# Altium schematic sheet PROC010C_LDO.SchDoc
size 431 x 279 mm; Date: Not shown in title block; ApprovedBy: Not shown in title block; CheckedBy: Not shown in title block; Author: Not shown in title block; CompanyName: Not shown in title block; DrawnBy: Adrian Ozer; Engineer: Not shown in title block; Organization: Not shown in title block; Address1: Not shown in title block; Address2: Not shown in title block; Address3: Not shown in title block; Address4: Not shown in title block; DocumentNumber: 9; Revision: Use project parameter SCH_Rev; SheetNumber: 9; SheetTotal: 16; PageSetup: Record=PageOptions|CenterHorizontal=True|CenterVertical=True|PrintScale=1.00|XCorrection=1.00|YCorrection=1.00|PrintKind=0|BorderSize=5000000|LeftOffset=0|BottomOffset=0|Orientation=2|PaperLength=1000|PaperWidth=1000|Scale=100|PaperSource=15|PrintQuality=600|MediaType=1|DitherType=10|PaperKind=Letter|PrintScaleMode=1; CurrentTime: Not shown in title block; CurrentDate: Not shown in title block; Time: Not shown in title block; DocumentFullPathAndName: Not shown in title block; DocumentName: Not shown in title block; ModifiedDate: Not shown in title block; ImagePath: Not shown in title block
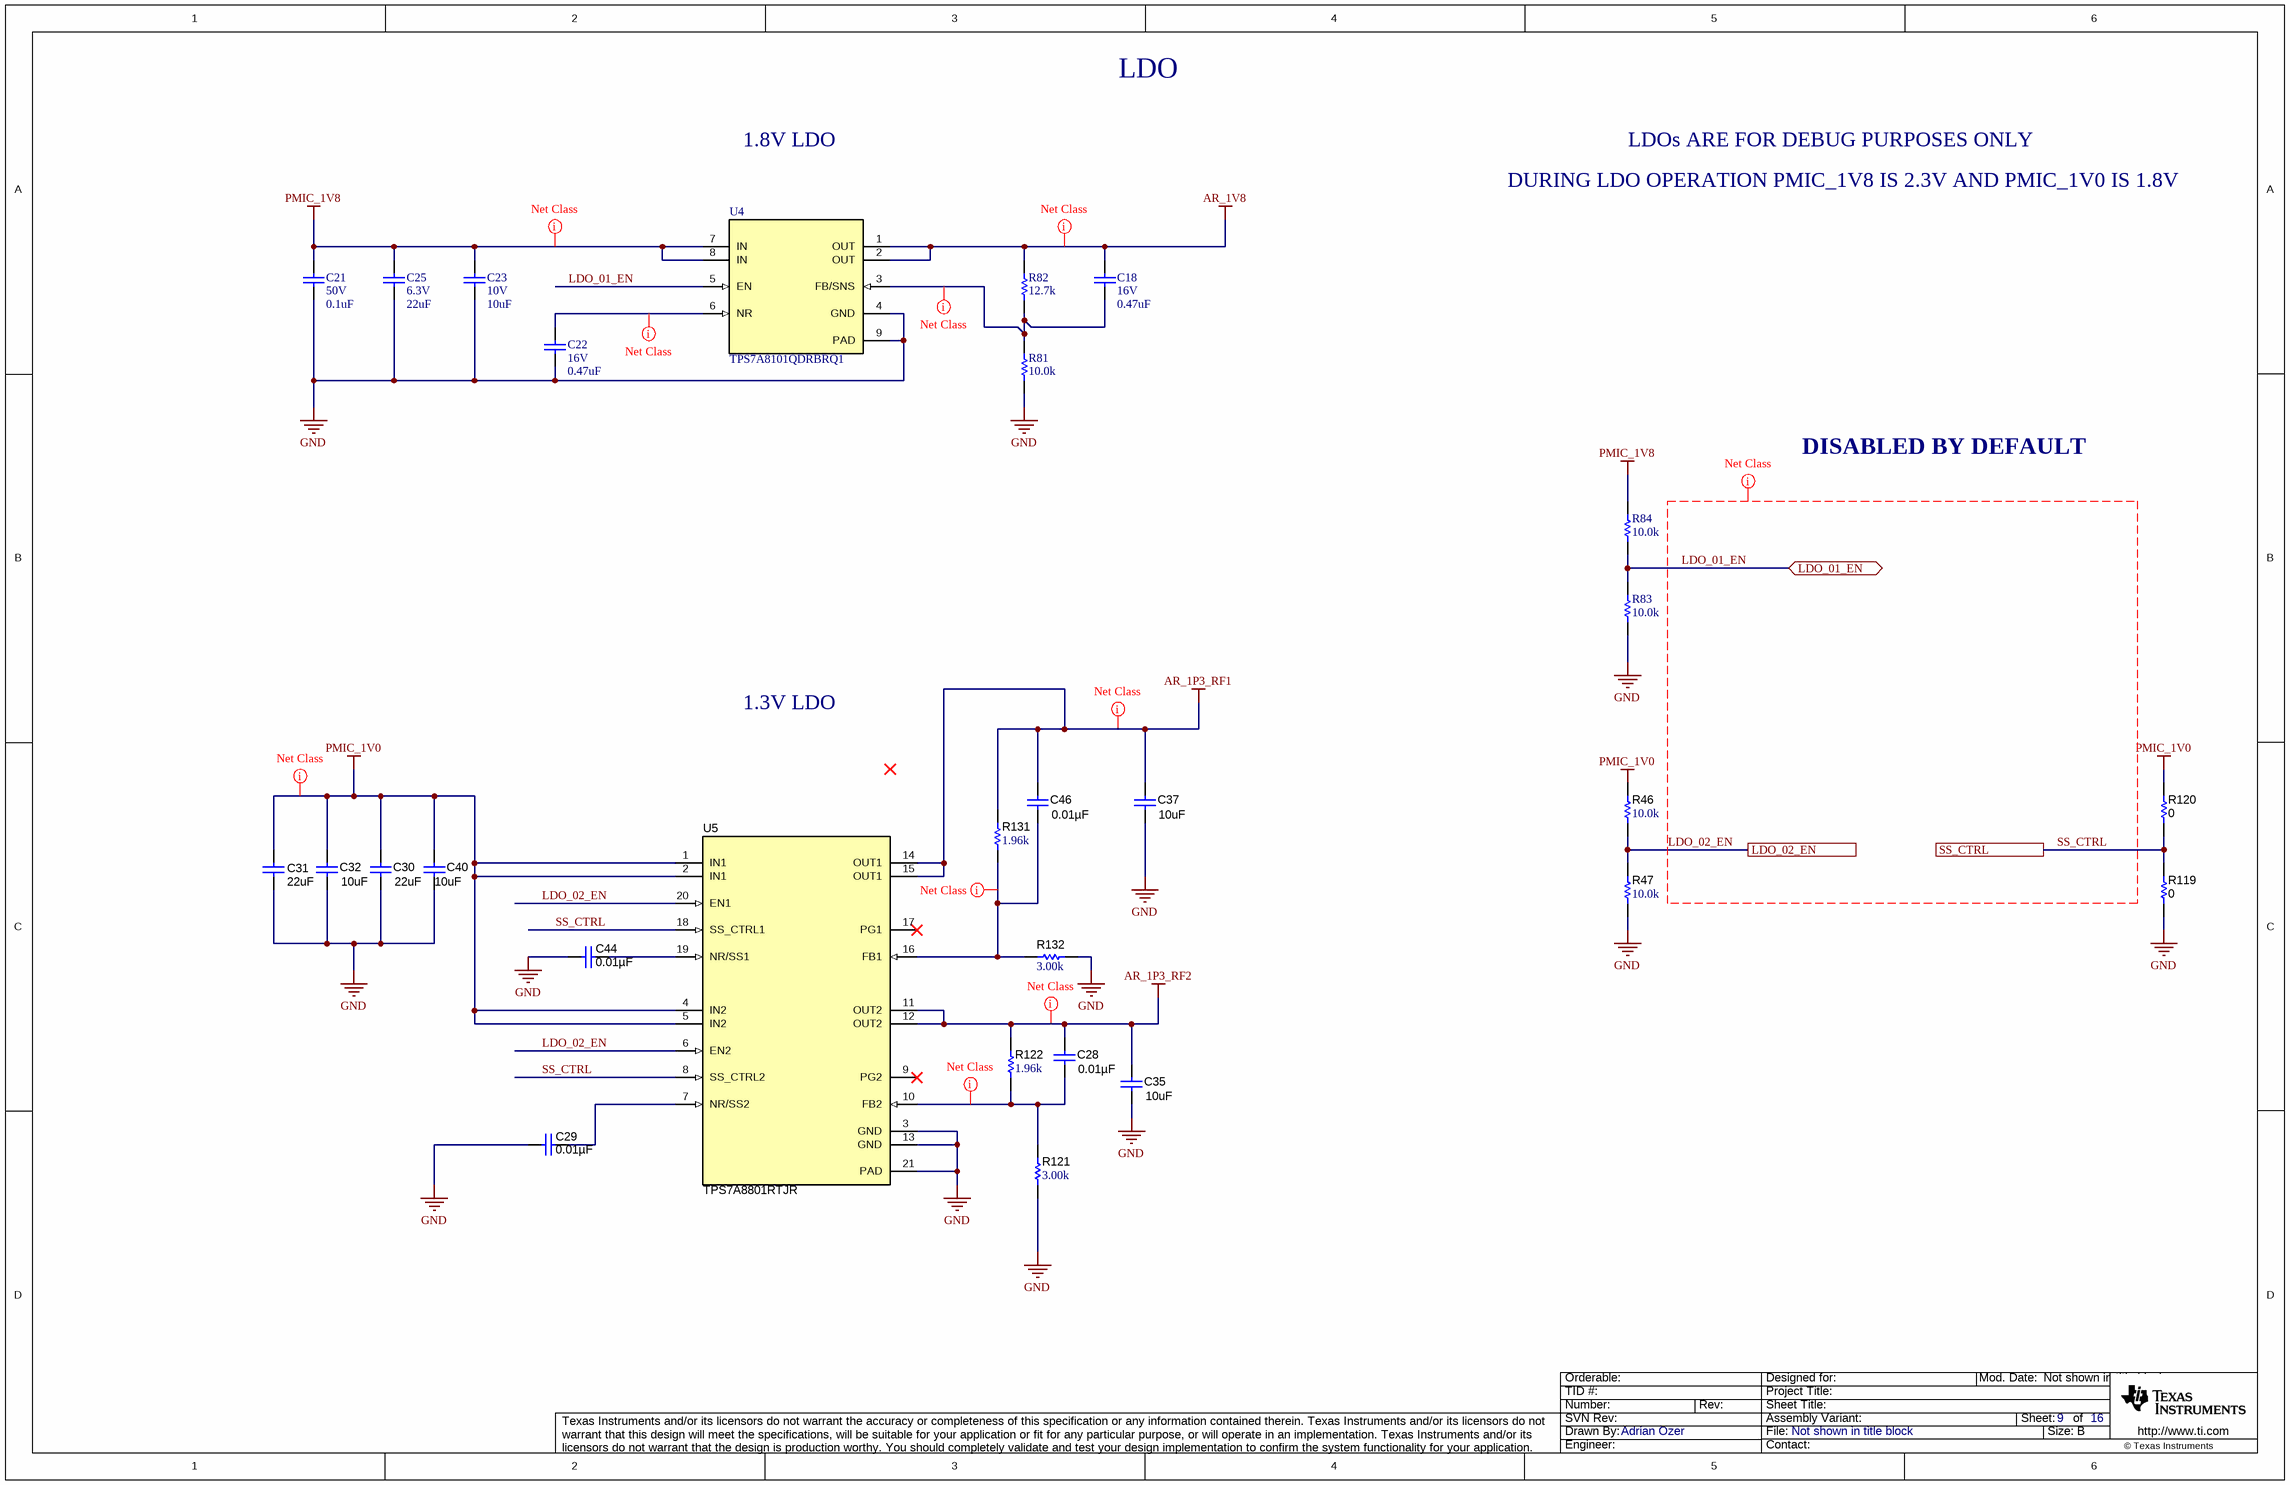
[diagram p0: PROC010C_LDO.SchDoc]

## Parts
C18  VDC_V: 16V  ValueDisplayed: 0.47uF  [0603]  (hidden comment: GCM188R71C474KA55D)
C21  VDC_V: 50V  ValueDisplayed: 0.1uF  [0402]  (hidden comment: CGA2B3X7R1H104K050BB)
C22  VDC_V: 16V  ValueDisplayed: 0.47uF  [0603]  (hidden comment: GCM188R71C474KA55D)
C23  VDC_V: 10V  ValueDisplayed: 10uF  [0805_HV]  (hidden comment: GCM21BR71A106KE22L)
C25  VDC_V: 6.3V  ValueDisplayed: 22uF  [1206_180]  (hidden comment: CGA5L1X7R0J226M160AC)
C28  ValueDisplayed: 0.01µF  [0402L]  (hidden comment: CGA2B3X8R1H103K050BB)
C29  ValueDisplayed: 0.01µF  [0402L]  (hidden comment: CGA2B3X8R1H103K050BB)
C30  ValueDisplayed: 22uF  [1206_180]  (hidden comment: CGA5L1X7R0J226M160AC)
C31  ValueDisplayed: 22uF  [1206_180]  (hidden comment: CGA5L1X7R0J226M160AC)
C32  ValueDisplayed: 10uF  [0805]  (hidden comment: GCM21BR71A106KE22L)
C35  ValueDisplayed: 10uF  [0805_HV]  (hidden comment: GCM21BR71A106KE22L)
C37  ValueDisplayed: 10uF  [0805_HV]  (hidden comment: GCM21BR71A106KE22L)
C40  ValueDisplayed: 10uF  [0805_HV1]  (hidden comment: GCM21BR71A106KE22L)
C44  ValueDisplayed: 0.01µF  [0402L]  (hidden comment: CGA2B3X8R1H103K050BB)
C46  ValueDisplayed: 0.01µF  [0402L]  (hidden comment: CGA2B3X8R1H103K050BB)
R46  ValueDisplayed: 10.0k  [0402L]  (hidden comment: CRCW040210K0FKED)
R47  ValueDisplayed: 10.0k  [0402L]  (hidden comment: CRCW040210K0FKED)
R81  ValueDisplayed: 10.0k  [0402L]  (hidden comment: CRCW040210K0FKED)
R82  ValueDisplayed: 12.7k  [0402L]  (hidden comment: CRCW040212K7FKED)
R83  ValueDisplayed: 10.0k  [0402]  (hidden comment: CRCW040210K0FKED)
R84  ValueDisplayed: 10.0k  [0402]  (hidden comment: CRCW040210K0FKED)
R119  ValueDisplayed: 0  [0402L]  (hidden comment: ERJ-2GE0R00X)
R120  ValueDisplayed: 0  [0402L]  (hidden comment: ERJ-2GE0R00X)
R121  ValueDisplayed: 3.00k  [0402L]  (hidden comment: CRCW04023K00FKED)
R122  ValueDisplayed: 1.96k  [0402L]  (hidden comment: CRCW04021K96FKED)
R131  ValueDisplayed: 1.96k  [0402L]  (hidden comment: CRCW04021K96FKED)
R132  ValueDisplayed: 3.00k  [0402L]  (hidden comment: CRCW04023K00FKED)
U4  TPS7A8101QDRBRQ1  [DRB0008A]
U5  TPS7A8801RTJR  [RTJ0020D]

## Ports
LDO_01_EN (bidir), LDO_02_EN, SS_CTRL

## Nets
AR_1P3_RF1: C37.2 C46.2 R131.2 U5.14(OUT1) U5.15(OUT1)
AR_1P3_RF2: C28.2 C35.2 R122.2 U5.11(OUT2) U5.12(OUT2)
AR_1V8: C18.1 R82.2 U4.1(OUT) U4.2(OUT)
GND: C21.2 C22.2 C23.2 C25.2 C29.1 C30.1 C31.1 C32.1 C35.1 C37.1 C40.1 C44.1 R47.2 R81.1 R83.1 R119.1 R121.1 R132.1 U4.4(GND) U4.9(PAD) U5.3(GND) U5.13(GND) U5.21(PAD)
PMIC_1V0: C30.2 C31.2 C32.2 C40.2 R46.1 R120.2 U5.1(IN1) U5.2(IN1) U5.4(IN2) U5.5(IN2)
PMIC_1V8: C21.1 C23.1 C25.1 R84.2 U4.7(IN) U4.8(IN)
LDO_01_EN: R83.2 R84.1 U4.5(EN) ; port LDO_01_EN
LDO_02_EN: R46.2 R47.1 U5.6(EN2) U5.20(EN1) ; port LDO_02_EN
SS_CTRL: R119.2 R120.1 U5.8(SS_CTRL2) U5.18(SS_CTRL1) ; port SS_CTRL
NetC18_2: C18.2 R81.2 R82.1 U4.3(FB/SNS)
NetC22_1: C22.1 U4.6(NR)
NetC28_1: C28.1 R121.2 R122.1 U5.10(FB2)
NetC29_2: C29.2 U5.7(NR/SS2)
NetC44_2: C44.2 U5.19(NR/SS1)
NetC46_1: C46.1 R131.1 R132.2 U5.16(FB1)

Not connected (* = marked no-connect by the designer): U5 9(PG2)* 17(PG1)*

## Layout directives
net class PWR: AR_1P3_RF1, AR_1P3_RF2, AR_1V8, NetC18_2, NetC28_1, NetC46_1, PMIC_1V0, PMIC_1V8
net class GENERAL: LDO_01_EN, LDO_02_EN, NetC22_1, SS_CTRL

## Notes on the sheet
- LDO
- 1.8V LDO
- LDOs ARE FOR DEBUG PURPOSES ONLY
- DURING LDO OPERATION PMIC_1V8 IS 2.3V AND PMIC_1V0 IS 1.8V
- DISABLED BY DEFAULT
- 1.3V LDO
- Drawn By:
- SVN Rev:
- Number:
- TID #:
- Orderable:
- Rev:
- Sheet Title:
- File:
- Project Title:
- Designed for:
- Assembly Variant:
- Mod. Date:
- Sheet:
- Size:
- of
- B
- http://www.ti.com
- Texas Instruments and/or its licensors do not warrant the accuracy or completeness of this specification or any information contained therein. Texas Instruments and/or its licensors do not warrant that this design will meet the specifications, will be suitable for your application or fit for any particular purpose, or will operate in an implementation. Texas Instruments and/or its licensors do not warrant that the design is production worthy. You should completely validate and test your design implementation to confirm the system functionality for your application.
- Engineer:
- Contact:
- © Texas Instruments

## Library data of the parts
C18 C22 = CMP-0007138-4: CAP, CERM, 0.47 uF, 16 V, +/- 10%, X7R, AEC-Q200 Grade 1, 0603; Manufacturer: MuRata; TaMin_C: -55°C; Polarized: N; SizeAreaWB_mm2: 4.68; Value1: Unknown; U/M: EA; Value: 0.47uF; TaMax_C: 125°C; SizeZ_mm: 1; SizeX_mm: 1.6; SizeY_mm: 0.8; SizeArea_mm2: 1.28; AEC Qualified: Y; Cap_F: 470nF; AEC Category: Q200; Supplier Part Number 2: 45Y5163; Publisher: Texas Instruments; Supplier 2: Newark; TempCo: X7R; Published: 2008-06-19; RoHS: Y; MountType: SMT; Supplier 1: Digi-Key; PackageReference: 0603; Tolerance_%: 10%; Cap_Case: 0603; Value2: 16V; CompType: Capacitor; LatestRevisionDate: 2017-03-09; PartNumber: GCM188R71C474KA55D; ComponentLink1Description: Datasheet link; AEC Grade: 1; Supplier Part Number 1: 490-4775-1-ND; Technology: Ceramic; ComponentLink1URL: http://psearch.en.murata.com/capacitor/product/GCM188R71C474KA55%23.pdf
C21 = CMP-0006325-2: CAP, CERM, 0.1 uF, 50 V, +/- 10%, X7R, AEC-Q200 Grade 1, 0402; Manufacturer: TDK; TaMin_C: -55°C; ESR_ohm: 0.039064; Polarized: N; SizeAreaWB_mm2: 3; Value1: 0.039064 ohm; U/M: EA; Value: 0.1uF; TaMax_C: 125°C; SizeZ_mm: 0.6; SizeX_mm: 1; SizeY_mm: 0.5; AEC Qualified: Y; Cap_F: 100nF; IRMS_A: 8.14669dA; AEC Category: Q200; Supplier Part Number 2: 04X3148; Publisher: Texas Instruments; Supplier 2: Newark; Supplier Part Number 3: 810-CGA2B3X7R1H104K; TempCo: X7R; Supplier 3: Mouser; Published: 2008-06-19; RoHS: Y; MountType: SMT; Supplier 1: Digi-Key; PackageReference: 0402; Tolerance_%: 10%; Cap_Case: 0402; Value2: 50V; SizeArea_mm2: 0.5; CompType: Capacitor; LatestRevisionDate: 2017-03-09; PartNumber: CGA2B3X7R1H104K050BB; ComponentLink1Description: Datasheet link; AEC Grade: 1; Supplier Part Number 1: 445-6899-1-ND; Technology: Ceramic; ComponentLink1URL: https://product.tdk.com/en/search/capacitor/ceramic/mlcc/info?part_no=CGA2B3X7R1H104K050BB
C23 = CMP-0008017-2: CAP, CERM, 10 uF, 10 V, +/- 10%, X7R, 0805; Manufacturer: MuRata; TaMin_C: -55°C; Polarized: N; SizeAreaWB_mm2: 6.75; Value1: Unknown; U/M: EA; Value: 10uF; TaMax_C: 125°C; SizeZ_mm: 1.45; SizeX_mm: 2; SizeY_mm: 1.25; Cap_Case: 0805; SizeArea_mm2: 2.5; Cap_F: 10µF; AEC Category: Q200; Supplier Part Number 2: 06AC6014; Publisher: Texas Instruments; Supplier 2: Newark; Supplier Part Number 3: 81-GCM21BR71A106KE2L; TempCo: X7R; Supplier 3: Mouser; Published: 2008-06-19; RoHS: Y; MountType: SMT; Supplier 1: Digi-Key; PackageReference: 0805; Tolerance_%: 10%; Value2: 10V; CompType: Capacitor; LatestRevisionDate: 2017-03-09; PartNumber: GCM21BR71A106KE22L; AEC Qualified: ?; ComponentLink1Description: Datasheet link; Supplier Part Number 1: 490-10674-1-ND; Technology: Ceramic; ComponentLink1URL: http://www.murata.com/products/catalog/pdf/c03e.pdf
C25 = CMP-0008770-2: CAP, CERM, 22 uF, 6.3 V, +/- 10%, X7R, AEC-Q200 Grade 1, 1206; Manufacturer: TDK; TaMin_C: -55°C; ESR_ohm: 1.872m; Polarized: N; SizeAreaWB_mm2: 10.92; Value1: 0.001872 ohm; U/M: EA; Value: 22uF; SizeZ_mm: 1.8; SizeX_mm: 3.2; SizeY_mm: 1.6; SizeArea_mm2: 5.12; AEC Qualified: Y; Cap_F: 22µF; IRMS_A: 5.30203A; AEC Grade: 1; AEC Category: Q200; TaMax_C: 125°C; Supplier Part Number 2: 52W9837; Publisher: Texas Instruments; Supplier 2: Newark; Supplier Part Number 3: 810-CGA5L1X7R0J226M; TempCo: X7R; Supplier 3: Mouser; Published: 2008-06-19; RoHS: Y; MountType: SMT; Supplier 1: Digi-Key; PackageReference: 1206; Tolerance_%: 10%; Cap_Case: 1206_180; Value2: 6.3V; CompType: Capacitor; LatestRevisionDate: 2017-03-09; PartNumber: CGA5L1X7R0J226M160AC; ComponentLink1Description: Datasheet link; Supplier Part Number 1: 445-7884-1-ND; Technology: Ceramic; ComponentLink1URL: https://product.tdk.com/en/search/capacitor/ceramic/mlcc/info?part_no=CGA5L1X7R0J226M160AC
C28 C29 C44 C46 = CMP-0078224-1: CAP, CERM, 0.01 µF, 50 V,+/- 10%, X8R, AEC-Q200 Grade 0, 0402; Manufacturer: TDK; TaMin_C: -55°C; Polarized: N; SizeAreaWB_mm2: 3; U/M: EA; Value: 0.01uF; TaMax_C: 150°C; SizeZ_mm: 0.6; SizeX_mm: 1; SizeY_mm: 0.5; Cap_Case: 0402; Value2: 50V; AEC Qualified: Y; Cap_F: 10nF; AEC Grade: 0; AEC Category: Q200; ComponentLink1URL: https://product.tdk.com/info/en/catalog/datasheets/mlcc_automotive_hightemp_en.pdf; Supplier Part Number 2: 51X6485; Supplier 2: Newark; Supplier Part Number 3: 810-CGA2B3X8R1H103KB; TempCo: X8R; Supplier 3: Mouser; RoHS: Y; MountType: SMT; Supplier 1: Digi-Key; PackageReference: 0402; Tolerance_%: 10%; SizeArea_mm2: 0.5; CompType: Capacitor; PartNumber: CGA2B3X8R1H103K050BB; VDC_V: 50V; ComponentLink1Description: Datasheet link; Supplier Part Number 1: 445-12303-1-ND; Technology: Ceramic
C30 C31 = CMP-0008770-2: CAP, CERM, 22 uF, 6.3 V, +/- 10%, X7R, AEC-Q200 Grade 1, 1206; Manufacturer: TDK; TaMin_C: -55°C; ESR_ohm: 1.872m; Polarized: N; SizeAreaWB_mm2: 10.92; Value1: 0.001872 ohm; U/M: EA; Value: 22uF; SizeZ_mm: 1.8; SizeX_mm: 3.2; SizeY_mm: 1.6; Value2: 6.3V; SizeArea_mm2: 5.12; AEC Qualified: Y; Cap_F: 22µF; IRMS_A: 5.30203A; AEC Grade: 1; AEC Category: Q200; TaMax_C: 125°C; Supplier Part Number 2: 52W9837; Publisher: Texas Instruments; Supplier 2: Newark; Supplier Part Number 3: 810-CGA5L1X7R0J226M; TempCo: X7R; Supplier 3: Mouser; Published: 2008-06-19; RoHS: Y; MountType: SMT; Supplier 1: Digi-Key; PackageReference: 1206; Tolerance_%: 10%; Cap_Case: 1206_180; CompType: Capacitor; LatestRevisionDate: 2017-03-09; PartNumber: CGA5L1X7R0J226M160AC; VDC_V: 6.3V; ComponentLink1Description: Datasheet link; Supplier Part Number 1: 445-7884-1-ND; Technology: Ceramic; ComponentLink1URL: https://product.tdk.com/en/search/capacitor/ceramic/mlcc/info?part_no=CGA5L1X7R0J226M160AC
C32 = CMP-0008017-2: CAP, CERM, 10 uF, 10 V, +/- 10%, X7R, 0805; Manufacturer: MuRata; TaMin_C: -55°C; Polarized: N; SizeAreaWB_mm2: 6.75; Value1: Unknown; U/M: EA; Value: 10uF; TaMax_C: 125°C; SizeZ_mm: 1.45; SizeX_mm: 2; SizeY_mm: 1.25; Value2: 10V; SizeArea_mm2: 2.5; CompType: Capacitor; Cap_F: 10µF; AEC Category: Q200; Supplier Part Number 2: 06AC6014; Publisher: Texas Instruments; Supplier 2: Newark; Supplier Part Number 3: 81-GCM21BR71A106KE2L; TempCo: X7R; Supplier 3: Mouser; Published: 2008-06-19; RoHS: Y; MountType: SMT; Supplier 1: Digi-Key; PackageReference: 0805; Tolerance_%: 10%; Cap_Case: 0805; LatestRevisionDate: 2017-03-09; PartNumber: GCM21BR71A106KE22L; AEC Qualified: ?; VDC_V: 10V; ComponentLink1Description: Datasheet link; Supplier Part Number 1: 490-10674-1-ND; Technology: Ceramic; ComponentLink1URL: http://www.murata.com/products/catalog/pdf/c03e.pdf
C35 C37 C40 = CMP-0008017-2: CAP, CERM, 10 uF, 10 V, +/- 10%, X7R, 0805; Manufacturer: MuRata; TaMin_C: -55°C; Polarized: N; SizeAreaWB_mm2: 6.75; Value1: Unknown; U/M: EA; Value: 10uF; TaMax_C: 125°C; SizeZ_mm: 1.45; SizeX_mm: 2; SizeY_mm: 1.25; Cap_Case: 0805; Value2: 10V; SizeArea_mm2: 2.5; CompType: Capacitor; Cap_F: 10µF; AEC Category: Q200; Supplier Part Number 2: 06AC6014; Publisher: Texas Instruments; Supplier 2: Newark; Supplier Part Number 3: 81-GCM21BR71A106KE2L; TempCo: X7R; Supplier 3: Mouser; Published: 2008-06-19; RoHS: Y; MountType: SMT; Supplier 1: Digi-Key; PackageReference: 0805; Tolerance_%: 10%; LatestRevisionDate: 2017-03-09; PartNumber: GCM21BR71A106KE22L; AEC Qualified: ?; VDC_V: 10V; ComponentLink1Description: Datasheet link; Supplier Part Number 1: 490-10674-1-ND; Technology: Ceramic; ComponentLink1URL: http://www.murata.com/products/catalog/pdf/c03e.pdf
R46 R47 R83 R84 = CMP-0025958-3: RES, 10.0 k, 1%, 0.063 W, AEC-Q200 Grade 0, 0402; Manufacturer: Vishay-Dale; Power_W: 63mW; TempCo: 100 ppm/C; Value_Code: 10k0; Value: 10.0k; EIA_Code: E96; Res_ohm: 10k; SizeX_mm: 1; SizeY_mm: 0.5; SizeZ_mm: 0.6; Value2: 0.063W; AEC Qualified: Y; VDC_V: 50V; AEC Category: Q200; AEC Grade: 0; Supplier Part Number 2: 52K6595; Supplier 2: Newark; Supplier Part Number 3: 71-CRCW0402-10K-E3; Supplier 3: Mouser; RoHS: E; Value1: 1%; MountType: SMT; Supplier 1: Digi-Key; PackageReference: 0402; Tolerance_%: 1%; SizeArea_mm2: 0.5; CompType: Resistor; PartNumber: CRCW040210K0FKED; ComponentLink1Description: Datasheet link; Supplier Part Number 1: 541-10.0KLCT-ND; Technology: Thick Film; ComponentLink1URL: http://www.vishay.com/docs/20035/dcrcwe3.pdf
R81 = CMP-0025958-3: RES, 10.0 k, 1%, 0.063 W, AEC-Q200 Grade 0, 0402; Manufacturer: Vishay-Dale; Power_W: 63mW; TempCo: 100 ppm/C; Value_Code: 10k0; Value: 10.0k; EIA_Code: E96; Res_ohm: 10k; SizeX_mm: 1; SizeY_mm: 0.5; SizeZ_mm: 0.6; Value2: 0.063W; CompType: Resistor; AEC Qualified: Y; VDC_V: 50V; AEC Category: Q200; AEC Grade: 0; Supplier Part Number 2: 52K6595; Supplier 2: Newark; Supplier Part Number 3: 71-CRCW0402-10K-E3; Supplier 3: Mouser; RoHS: E; Value1: 1%; MountType: SMT; Supplier 1: Digi-Key; PackageReference: 0402; Tolerance_%: 1%; SizeArea_mm2: 0.5; PartNumber: CRCW040210K0FKED; ComponentLink1Description: Datasheet link; Supplier Part Number 1: 541-10.0KLCT-ND; Technology: Thick Film; ComponentLink1URL: http://www.vishay.com/docs/20035/dcrcwe3.pdf
R82 = CMP-0025993-3: RES, 12.7 k, 1%, 0.063 W, AEC-Q200 Grade 0, 0402; Manufacturer: Vishay-Dale; Power_W: 63mW; TempCo: 100 ppm/C; Value_Code: 12k7; Value: 12.7k; EIA_Code: E96; SizeX_mm: 1; SizeY_mm: 0.5; SizeZ_mm: 0.6; Value2: 0.063W; CompType: Resistor; AEC Qualified: Y; VDC_V: 50V; AEC Category: Q200; AEC Grade: 0; Supplier Part Number 2: 52K6650; Supplier 2: Newark; Supplier Part Number 3: 71-CRCW0402-12.7K-E3; Supplier 3: Mouser; RoHS: E; Value1: 1%; MountType: SMT; Supplier 1: Digi-Key; PackageReference: 0402; Tolerance_%: 1%; Res_ohm: 12.7k; SizeArea_mm2: 0.5; PartNumber: CRCW040212K7FKED; ComponentLink1Description: Datasheet link; Supplier Part Number 1: 541-12.7KLCT-ND; Technology: Thick Film; ComponentLink1URL: http://www.vishay.com/docs/20035/dcrcwe3.pdf
R119 = CMP-0026992-2: RES, 0, 5%, 0.063 W, 0402; Manufacturer: Panasonic; Power_W: 63mW; TempCo: 600 ppm/C; Value_Code: 0000; U/M: EA; Value: 0; EIA_Code: E24; SizeX_mm: 1; SizeY_mm: 0.5; SizeZ_mm: 0.6; Value2: 0.063W; VDC_V: 50V; AEC Category: Q200; Supplier Part Number 2: 65T8307; Publisher: Texas Instruments; Supplier 2: Newark; Supplier Part Number 3: 667-ERJ-2GE0R00X; Supplier 3: Mouser; Published: 2008-06-26; RoHS: Y; Value1: 5%; MountType: SMT; Supplier 1: Digi-Key; PackageReference: 0402; Tolerance_%: 5%; Res_ohm: 0; SizeArea_mm2: 0.5; CompType: Resistor; LatestRevisionDate: 2017-03-09; PartNumber: ERJ-2GE0R00X; AEC Qualified: ?; ComponentLink1Description: Datasheet link; Supplier Part Number 1: P0.0JCT-ND; Technology: Thick Film; ComponentLink1URL: http://www.panasonic.com/industrial/components/pdf/AOA0000CE1.pdf
R120 = CMP-0026992-2: RES, 0, 5%, 0.063 W, 0402; Manufacturer: Panasonic; Power_W: 63mW; TempCo: 600 ppm/C; Value_Code: 0000; U/M: EA; Value: 0; EIA_Code: E24; SizeX_mm: 1; SizeY_mm: 0.5; SizeZ_mm: 0.6; Value2: 0.063W; CompType: Resistor; VDC_V: 50V; AEC Category: Q200; INSTALATION: DNP; Supplier Part Number 2: 65T8307; Publisher: Texas Instruments; Supplier 2: Newark; Supplier Part Number 3: 667-ERJ-2GE0R00X; Supplier 3: Mouser; Published: 2008-06-26; RoHS: Y; Value1: 5%; MountType: SMT; Supplier 1: Digi-Key; PackageReference: 0402; Tolerance_%: 5%; Res_ohm: 0; SizeArea_mm2: 0.5; LatestRevisionDate: 2017-03-09; PartNumber: ERJ-2GE0R00X; AEC Qualified: ?; ComponentLink1Description: Datasheet link; Supplier Part Number 1: P0.0JCT-ND; Technology: Thick Film; ComponentLink1URL: http://www.panasonic.com/industrial/components/pdf/AOA0000CE1.pdf
R121 R132 = CMP-0078211-2: RES, 3.00 k, 1%, 0.063 W, AEC-Q200 Grade 0, 0402; Manufacturer: Vishay-Dale; Value_Code: 3k00; SizeArea_mm2: 0.5; AEC Qualified: Y; AEC Category: Q200; Res_ohm: 3k; Value: 3.00k; SizeZ_mm: 0.6; TempCo: 100 ppm/C; AEC Grade: 0; Power_W: 63mW; VDC_V: 50V; Value2: 0.063W; SizeX_mm: 1; ComponentLink1Description: Datasheet link; RoHS: E; Tolerance_%: 1%; Supplier 1: Newark; PackageReference: 0402; Technology: Thick Film; PartNumber: CRCW04023K00FKED; SizeY_mm: 0.5; ComponentLink1URL: http://www.vishay.com/docs/20035/dcrcwe3.pdf; Value1: 1%; CompType: Resistor; MountType: SMT; Supplier Part Number 1: 52K6934
R122 R131 = CMP-0026099-2: RES, 1.96 k, 1%, 0.063 W, AEC-Q200 Grade 0, 0402; Manufacturer: Vishay-Dale; Power_W: 63mW; TempCo: 100 ppm/C; Value_Code: 1k96; Value: 1.96k; EIA_Code: E96; SizeX_mm: 1; SizeY_mm: 0.5; SizeZ_mm: 0.6; Value2: 0.063W; AEC Qualified: Y; VDC_V: 50V; AEC Category: Q200; AEC Grade: 0; ComponentLink1URL: http://www.vishay.com/docs/20035/dcrcwe3.pdf; Supplier Part Number 2: 52K6592; Supplier 2: Newark; Supplier Part Number 3: 71-CRCW0402-1.96K-E3; Supplier 3: Mouser; RoHS: E; Value1: 1%; MountType: SMT; Supplier 1: Digi-Key; PackageReference: 0402; Tolerance_%: 1%; Res_ohm: 1.96k; SizeArea_mm2: 0.5; CompType: Resistor; PartNumber: CRCW04021K96FKED; ComponentLink1Description: Datasheet link; Supplier Part Number 1: 541-1.96KLCT-ND; Technology: Thick Film
U4 = CMP-0073870-2: Automotive Low-Noise, Wide-Bandwidth, High PSRR, Low-Dropout 1-A Linear Regulator, DRB0008A (VSON-8); Manufacturer: Texas Instruments; SizeZ_mm: 1.0; SizeX_mm: 3.0; SizeArea_mm2: 9.0; CompType: IC; U/M: EA; SizeAreaWB_mm2: 16.0; ComponentLink1URL: http://www.ti.com/lit/ds/symlink/tps7a8101-q1.pdf; Publisher: Texas Instruments; PackageDescription: VSON-8; SizeY_mm: 3.0; PackageReference: DRB0008A; LatestRevisionDate: 2017-06-09; RoHS: Y; MountType: SMT; PartNumber: TPS7A8101QDRBRQ1; Alternate Manufacturer: Texas Instruments; ComponentLink1Description: Datasheet Link
U5 = CMP-0073732-2: Dual, 1-A, Low Noise (3.8-uVRMS), LDO Voltage Regulator, RTJ0020D (WQFN-20); Alternate PartNumber: TPS7A8801RTJT; Alternate Manufacturer: Texas Instruments; Green_Lifecycle: Active; SizeAreaWB_mm2: 25.0; Green_REACh: Passed; U/M: EA; SizeZ_mm: 0.8; SizeX_mm: 4.0; SizeArea_mm2: 16.0; CompType: IC; ComponentLink1URL: http://www.ti.com/lit/ds/symlink/tps7a88.pdf; Publisher: Texas Instruments; PackageDescription: WQFN-20; RoHS: Y; MountType: SMT; Green_EU RoHS-2: Passed; Manufacturer: Texas Instruments; Green_EU RoHS: Passed; PackageReference: RTJ0020D; SizeY_mm: 4.0; LatestRevisionDate: 2017-06-09; PartNumber: TPS7A8801RTJR; ComponentLink1Description: Datasheet Link